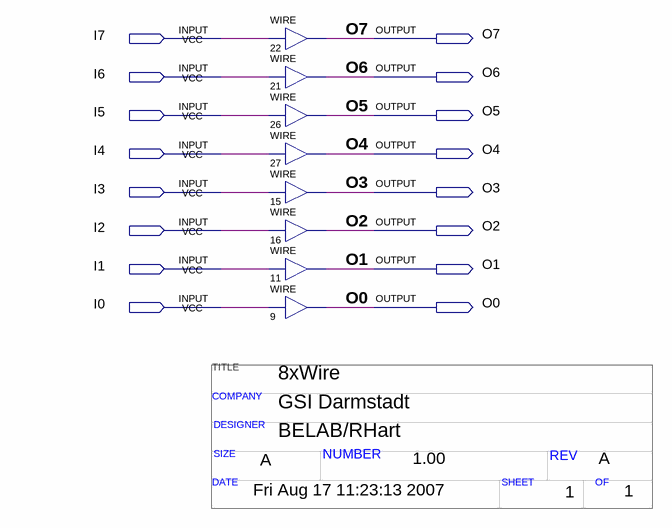
[diagram p0: schematic sheet]
// Quartus schematic 8xwire.bdf as structural Verilog: 8 symbols, 16 pins
// Title block: TITLE: 8xWire; COMPANY: GSI Darmstadt; DESIGNER: BELAB/RHart; SIZE: A; NUMBER: 1.00; REV: A; DATE: Fri Aug 17 11:23:13 2007; SHEET: 1; OF: 1
module \8xwire  (
  input  I7,
  input  I6,
  input  I5,
  input  I4,
  input  I3,
  input  I2,
  input  I1,
  input  I0,
  output O7,
  output O6,
  output O5,
  output O4,
  output O3,
  output O2,
  output O1,
  output O0
);

  assign O7 = I7;  // WIRE 22
  assign O6 = I6;  // WIRE 21
  assign O5 = I5;  // WIRE 26
  assign O4 = I4;  // WIRE 27
  assign O3 = I3;  // WIRE 15
  assign O2 = I2;  // WIRE 16
  assign O1 = I1;  // WIRE 11
  assign O0 = I0;  // WIRE 9
endmodule
